# EAGLE schematic 16-Sensors(Sch) (EAGLE 7.7.0)
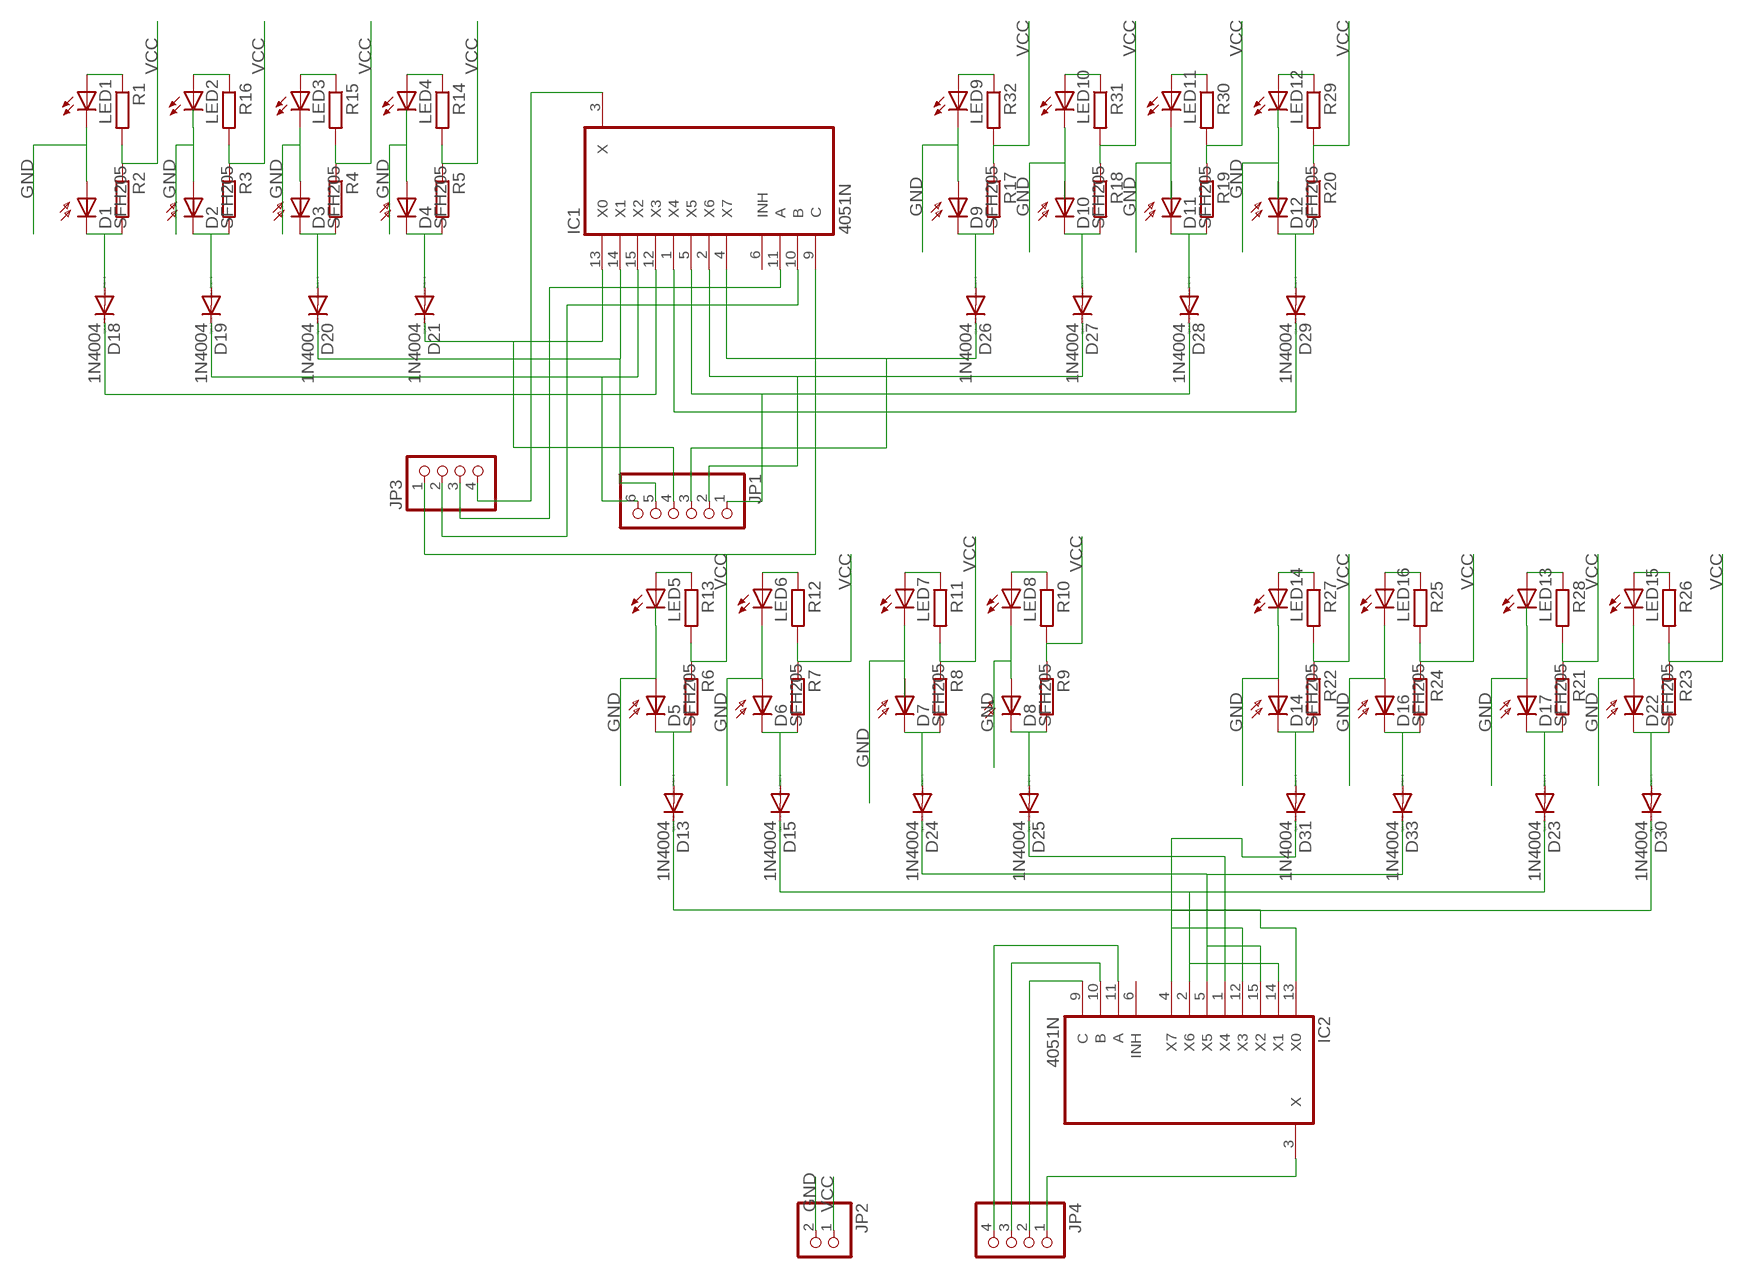
[diagram p0: schematic, sheet 1]

## Parts
D1  SFH205  [SFH205]
D2  SFH205  [SFH205]
D3  SFH205  [SFH205]
D4  SFH205  [SFH205]
D5  SFH205  [SFH205]
D6  SFH205  [SFH205]
D7  SFH205  [SFH205]
D8  SFH205  [SFH205]
D9  SFH205  [SFH205]
D10  SFH205  [SFH205]
D11  SFH205  [SFH205]
D12  SFH205  [SFH205]
D13  1N4004  [DO41-10]
D14  SFH205  [SFH205]
D15  1N4004  [DO41-10]
D16  SFH205  [SFH205]
D17  SFH205  [SFH205]
D18  1N4004  [DO41-10]
D19  1N4004  [DO41-10]
D20  1N4004  [DO41-10]
D21  1N4004  [DO41-10]
D22  SFH205  [SFH205]
D23  1N4004  [DO41-10]
D24  1N4004  [DO41-10]
D25  1N4004  [DO41-10]
D26  1N4004  [DO41-10]
D27  1N4004  [DO41-10]
D28  1N4004  [DO41-10]
D29  1N4004  [DO41-10]
D30  1N4004  [DO41-10]
D31  1N4004  [DO41-10]
D33  1N4004  [DO41-10]
IC1  4051N  [DIL16]
IC2  4051N  [DIL16]
JP1  PINHD-1X6  [1X06]
JP2  PINHD-1X2  [1X02]
JP3  PINHD-1X4  [1X04]
JP4  PINHD-1X4  [1X04]
LED1  LED5MM  [LED5MM]
LED2  LED5MM  [LED5MM]
LED3  LED5MM  [LED5MM]
LED4  LED5MM  [LED5MM]
LED5  LED5MM  [LED5MM]
LED6  LED5MM  [LED5MM]
LED7  LED5MM  [LED5MM]
LED8  LED5MM  [LED5MM]
LED9  LED5MM  [LED5MM]
LED10  LED5MM  [LED5MM]
LED11  LED5MM  [LED5MM]
LED12  LED5MM  [LED5MM]
LED13  LED5MM  [LED5MM]
LED14  LED5MM  [LED5MM]
LED15  LED5MM  [LED5MM]
LED16  LED5MM  [LED5MM]
R1  R-EU_0204/5  [0204/5]
R2  R-EU_0204/5  [0204/5]
R3  R-EU_0204/5  [0204/5]
R4  R-EU_0204/5  [0204/5]
R5  R-EU_0204/5  [0204/5]
R6  R-EU_0204/5  [0204/5]
R7  R-EU_0204/5  [0204/5]
R8  R-EU_0204/5  [0204/5]
R9  R-EU_0204/5  [0204/5]
R10  R-EU_0204/5  [0204/5]
R11  R-EU_0204/5  [0204/5]
R12  R-EU_0204/5  [0204/5]
R13  R-EU_0204/5  [0204/5]
R14  R-EU_0204/5  [0204/5]
R15  R-EU_0204/5  [0204/5]
R16  R-EU_0204/5  [0204/5]
R17  R-EU_0204/5  [0204/5]
R18  R-EU_0204/5  [0204/5]
R19  R-EU_0204/5  [0204/5]
R20  R-EU_0204/5  [0204/5]
R21  R-EU_0204/5  [0204/5]
R22  R-EU_0204/5  [0204/5]
R23  R-EU_0204/5  [0204/5]
R24  R-EU_0204/5  [0204/5]
R25  R-EU_0204/5  [0204/5]
R26  R-EU_0204/5  [0204/5]
R27  R-EU_0204/5  [0204/5]
R28  R-EU_0204/5  [0204/5]
R29  R-EU_0204/5  [0204/5]
R30  R-EU_0204/5  [0204/5]
R31  R-EU_0204/5  [0204/5]
R32  R-EU_0204/5  [0204/5]

## Nets
GND: D1.A D2.A D3.A D4.A D5.A D6.A D7.A D8.A D9.A D10.A D11.A D12.A D14.A D16.A D17.A D22.A JP2.2 LED1.K(C) LED2.K(C) LED3.K(C) LED4.K(C) LED5.K(C) LED6.K(C) LED7.K(C) LED8.K(C) LED9.K(C) LED10.K(C) LED11.K(C) LED12.K(C) LED13.K(C) LED14.K(C) LED15.K(C) LED16.K(C)
N$1: LED9.A R32.1
N$2: LED10.A R31.1
N$3: LED11.A R30.1
N$4: LED12.A R29.1
N$5: D26.C IC1.4(X7) JP1.3
N$6: LED14.A R27.1
N$7: D21.C IC1.13(X0) JP1.4
N$8: D20.C IC1.14(X1) JP1.5
N$9: LED1.A R1.1
N$10: LED2.A R16.1
N$11: LED3.A R15.1
N$12: LED4.A R14.1
N$13: D27.C IC1.2(X6) JP1.2
N$14: D19.C IC1.15(X2) JP1.6
N$15: D18.C IC1.12(X3)
N$17: D28.C IC1.5(X5) JP1.1
N$18: D3.K(C) D20.A R4.2
N$19: IC1.3(X) JP3.4
N$20: D29.C IC1.1(X4)
N$21: IC1.11(A) JP3.3
N$22: IC1.10(B) JP3.2
N$23: LED5.A R13.1
N$24: IC1.9(C) JP3.1
N$25: LED7.A R11.1
N$26: LED8.A R10.1
N$27: D5.K(C) D13.A R6.2
N$28: D6.K(C) D15.A R7.2
N$29: LED6.A R12.1
N$30: LED13.A R28.1
N$31: D17.K(C) D23.A R21.2
N$32: D16.K(C) D33.A R24.2
N$33: D22.K(C) D30.A R23.2
N$34: LED15.A R26.1
N$35: D31.C IC2.1(X4)
N$36: D33.C IC2.5(X5)
N$38: D30.C IC2.4(X7)
N$39: D25.C IC2.12(X3)
N$40: D24.C IC2.15(X2)
N$41: D15.C IC2.14(X1)
N$42: D13.C IC2.13(X0)
N$43: IC2.3(X) JP4.1
N$44: IC2.9(C) JP4.2
N$45: IC2.10(B) JP4.3
N$46: IC2.11(A) JP4.4
N$47: D1.K(C) D18.A R2.2
N$48: D2.K(C) D19.A R3.2
N$49: D23.C IC2.2(X6)
N$50: D4.K(C) D21.A R5.2
N$53: D7.K(C) D24.A R8.2
N$54: D8.K(C) D25.A R9.2
N$55: D9.K(C) D26.A R17.2
N$56: D10.K(C) D27.A R18.2
N$57: D11.K(C) D28.A R19.2
N$58: D12.K(C) D29.A R20.2
N$60: D14.K(C) D31.A R22.2
N$62: LED16.A R25.1
VCC: JP2.1 R1.2 R2.1 R3.1 R4.1 R5.1 R6.1 R7.1 R8.1 R9.1 R10.2 R11.2 R12.2 R13.2 R14.2 R15.2 R16.2 R17.1 R18.1 R19.1 R20.1 R21.1 R22.1 R23.1 R24.1 R25.2 R26.2 R27.2 R28.2 R29.2 R30.2 R31.2 R32.2
Unconnected: IC1.6(INH) IC2.6(INH)

## Power pins joined to a net without a drawn wire
GND: IC1.8(GND) IC2.8(GND)
VCC: IC1.16(VCC) IC2.16(VCC)
VEE: IC1.7(VEE) IC2.7(VEE)

## Library data of the parts
D1-D12 D14 D16 D17 D22 = opto-trans-siemens:SFH205: PHOTO DIODE; OC_FARNELL: unknown; OC_NEWARK: unknown
D13 D15 D18-D21 D23-D31 D33 = diode:1N4004: DIODE general purpose rectifier, 1 A
IC1 IC2 = 40xx:4051: 8-channel ANALOG MULTIPLEXER
JP1 = pinhead:PINHD-1X6: PIN HEADER
JP2 = pinhead:PINHD-1X2: PIN HEADER
JP3 JP4 = pinhead:PINHD-1X4: PIN HEADER
LED1-LED16 = led:LED: LED OSRAM: - CHIPLED LG R971, LG N971, LY N971, LG Q971, LY Q971, LO R971, LY R971 LH N974, LH R974 LS Q976, LO Q976, LY Q976 LO Q996 - Hyper CHIPLED LW Q18S LB Q993, LB Q99A, LB R99A - SideLED LS A670, LO A670, LY A670, LG A670, LP A670 LB A673, LV A673, LT A673, LW A673 LH A674 LY A675 LS A676, LA A676, LO A676, LY A676, LW A676 LS A679, LY A679, LG A679 - Hyper Micro SIDELED® LS Y876, LA Y876, LO Y876, LY Y876 LT Y87S - SmartLED LW L88C, LW L88S LB L89C, LB L89S, LG L890 LS L89K, LO L89K, LY L89K LS L896, LA L896, LO L896, LY L896 - TOPLED LS T670, LO T670, LY T670, LG T670, LP T670 LSG T670, LSP T670, LSY T670, LOP T670, LYG T670 LG T671, LOG T671, LSG T671 LB T673, LV T673, LT T673, LW T673 LH T674 LS T676, LA T676, LO T676, LY T676, LB T676, LH T676, LSB T676, LW T676 LB T67C, LV T67C, LT T67C, LS T67K, LO T67K, LY T67K, LW E67C LS E67B, LA E67B, LO E67B, LY E67B, LB E67C, LV E67C, LT E67C LW T67C LS T679, LY T679, LG T679 LS T770, LO T770, LY T770, LG T770, LP T770 LB T773, LV T773, LT T773, LW T773 LH T774 LS E675, LA E675, LY E675, LS T675 LS T776, LA T776, LO T776, LY T776, LB T776 LHGB T686 LT T68C, LB T68C - Hyper Mini TOPLED® LB M676 - Mini TOPLED Santana® LG M470 LS M47K, LO M47K, LY M47K Source: http://www.osram.convergy.de LUXEON: - LUMILED® LXK2-PW12-R00, LXK2-PW12-S00, LXK2-PW14-U00, LXK2-PW14-V00 LXK2-PM12-R00, LXK2-PM12-S00, LXK2-PM14-U00 LXK2-PE12-Q00, LXK2-PE12-R00, LXK2-PE12-S00, LXK2-PE14-T00, LXK2-PE14-U00 LXK2-PB12-K00, LXK2-PB12-L00, LXK2-PB12-M00, LXK2-PB14-N00, LXK2-PB14-P00, LXK2-PB14-Q00 LXK2-PR12-L00, LXK2-PR12-M00, LXK2-PR14-Q00, LXK2-PR14-R00 LXK2-PD12-Q00, LXK2-PD12-R00, LXK2-PD12-S00 LXK2-PH12-R00, LXK2-PH12-S00 LXK2-PL12-P00, LXK2-PL12-Q00, LXK2-PL12-R00 Source: www.luxeon.com KINGBRIGHT: KA-3528ASYC Source: www.kingbright.com
R1-R32 = rcl:R-EU_: RESISTOR, European symbol